# EAGLE design Light TO220 (EAGLE 9.2.2)
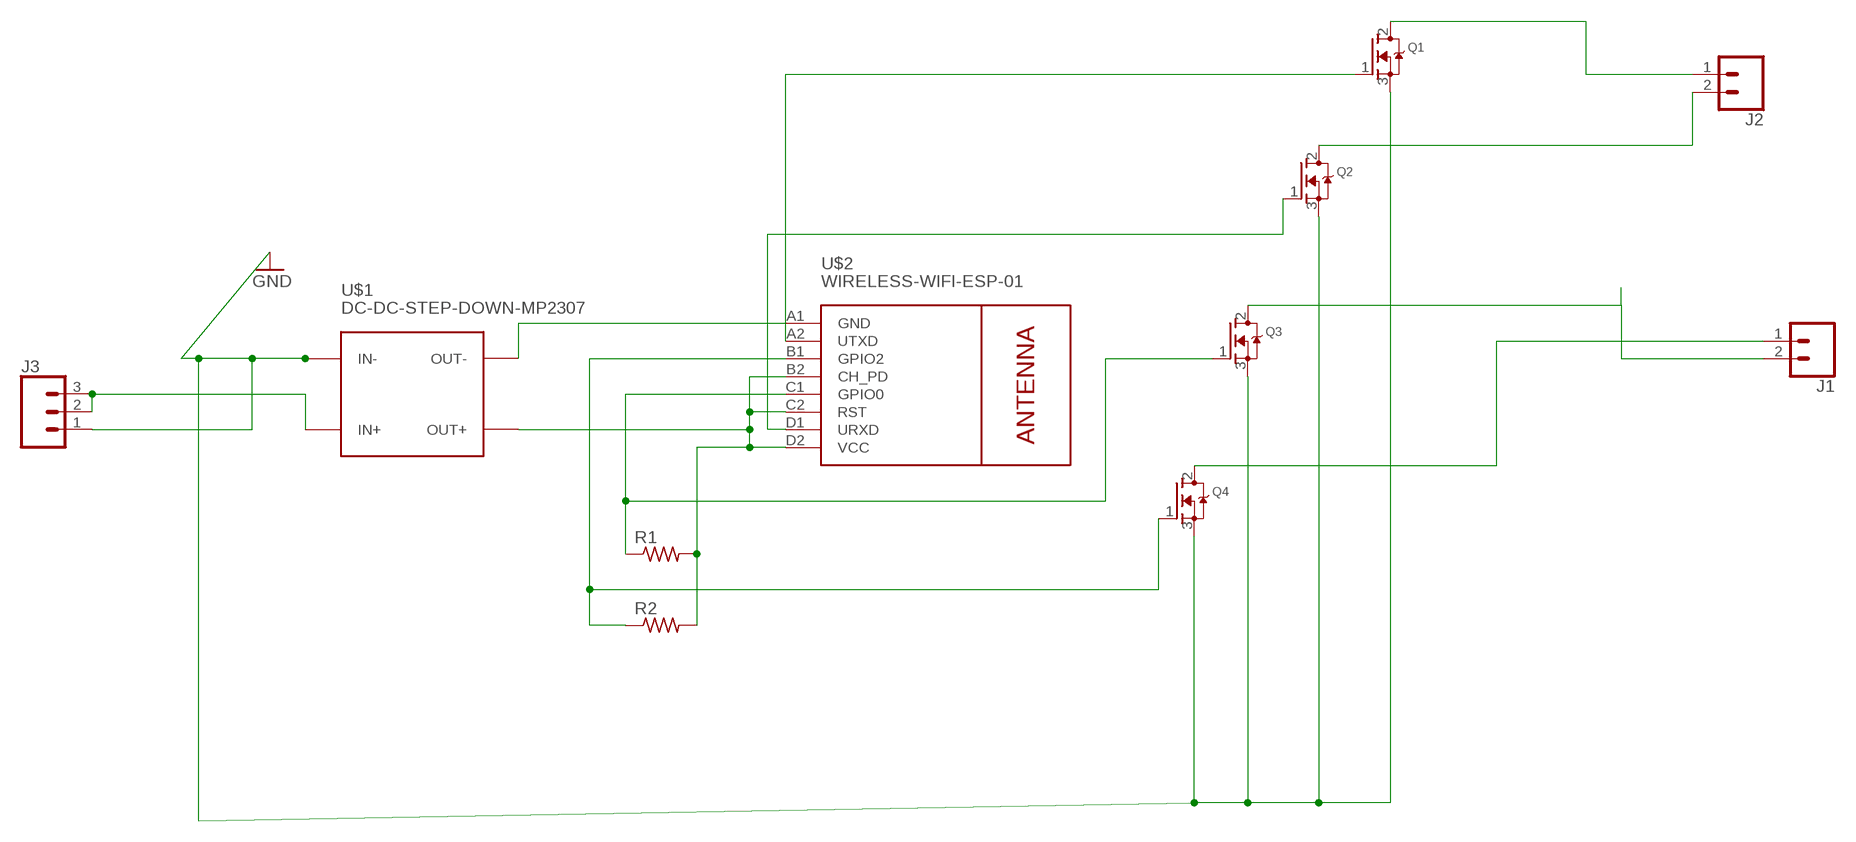
[diagram p0: schematic, sheet 1]

## Parts
J1  CONN_023.5MM  [SCREWTERMINAL-3.5MM-2]
J2  CONN_023.5MM  [SCREWTERMINAL-3.5MM-2]
J3  CONN_03SCREW  [SCREWTERMINAL-3.5MM-3]
Q1  MOSFET-NGDS_TO220V  [TO220V]
Q2  MOSFET-NGDS_TO220V  [TO220V]
Q3  MOSFET-NGDS_TO220V  [TO220V]
Q4  MOSFET-NGDS_TO220V  [TO220V]
R1  R-US_R0805  [R0805]
R2  R-US_R0805  [R0805]
U$1  DC-DC-STEP-DOWN-MP2307  [DC-DC-STEP-DOWN-MP2307]
U$2  WIRELESS-WIFI-ESP-01  [WIRELESS-WIFI-ESP-01]

## Nets
GND: J3.1 Q1.3(S) Q2.3(S) Q3.3(S) Q4.3(S) U$1.IN-
N$1: R1.2 R2.2 U$1.OUT+ U$2.B2(CH_PD) U$2.C2(RST) U$2.D2(VCC)
N$2: Q2.1(G) U$2.D1(URXD)
N$3: U$1.OUT- U$2.A1(GND)
N$4: Q3.1(G) R1.1 U$2.C1(GPIO0)
N$5: Q4.1(G) R2.1 U$2.B1(GPIO2)
N$6: Q1.1(G) U$2.A2(UTXD)
N$7: J3.2 J3.3 U$1.IN+
N$8: J2.1 Q1.2(D)
N$9: J2.2 Q2.2(D)
N$10: J1.1 Q4.2(D)
N$11: J1.2 Q3.2(D)

## Library data of the parts
J1 J2 = custom:CONN_02: Multi connection point. Often used as Generic Header-pin footprint for 0.1 inch spaced/style header connections On any of the 0.1 inch spaced packages, you can populate with these: Break Away Headers - Straight <https://www.sparkfun.com/products/116> (PRT-00116) Break Away Male Headers - Right Angle <https://www.sparkfun.com/products/553> (PRT-00553) Female Headers <https://www.sparkfun.com/products/115> (PRT-00115) Break Away Headers - Machine Pin <https://www.sparkfun.com/products/117> (PRT-00117) Break Away Female Headers - Swiss Machine Pin <https://www.sparkfun.com/products/743> (PRT-00743) For SCREWTERMINALS and SPRING TERMINALS visit here: Screw Terimnals on SparkFun.com <https://www.sparkfun.com/search/results?term=Screw+Terminals> (5mm/3.5mm/2.54mm spacing) This device is also useful as a general connection point to wire up your design to another part of your project. Our various solder wires solder well into these plated through hole pads. Hook-Up Wire - Assortment (Stranded, 22 AWG) <https://www.sparkfun.com/products/11375> (PRT-11375) Hook-Up Wire - Assortment (Solid Core, 22 AWG) <https://www.sparkfun.com/products/11367> (PRT-11367) View the entire wire category on our website here <https://www.sparkfun.com/categories/141> Special notes: Molex polarized connector foot print use with: PRT-08233 with associated crimp pins and housings. 2.54_SCREWTERM for use with PRT-10571. 3.5mm Screw Terminal footprints for PRT-08084 5mm Screw Terminal footprints for use with PRT-08432; PROD_ID: CONN-08399
J3 = custom:CONN_03: Multi connection point. Often used as Generic Header-pin footprint for 0.1 inch spaced/style header connections On any of the 0.1 inch spaced packages, you can populate with these: Break Away Headers - Straight <https://www.sparkfun.com/products/116> (PRT-00116) Break Away Male Headers - Right Angle <https://www.sparkfun.com/products/553> (PRT-00553) Female Headers <https://www.sparkfun.com/products/115> (PRT-00115) Break Away Headers - Machine Pin <https://www.sparkfun.com/products/117> (PRT-00117) Break Away Female Headers - Swiss Machine Pin <https://www.sparkfun.com/products/743> (PRT-00743) Stackable Header - 3 Pin (Female, 0.1") <https://www.sparkfun.com/products/13875> (PRT-13875) For SCREWTERMINALS and SPRING TERMINALS visit here: Screw Terimnals on SparkFun.com <https://www.sparkfun.com/search/results?term=Screw+Terminals> (5mm/3.5mm/2.54mm spacing) This device is also useful as a general connection point to wire up your design to another part of your project. Our various solder wires solder well into these plated through hole pads. Hook-Up Wire - Assortment (Stranded, 22 AWG) <https://www.sparkfun.com/products/11375> (PRT-11375) Hook-Up Wire - Assortment (Solid Core, 22 AWG) <https://www.sparkfun.com/products/11367> (PRT-11367) View the entire wire category on our website here <https://www.sparkfun.com/categories/141> Special notes: Molex polarized connector foot print use with SKU : PRT-08232 with associated crimp pins and housings.; PROD_ID: CONN-08288; SF_ID: PRT-08235
Q1-Q4 = adafruit:MOSFET-N: N-Channel Mosfet 2N7002E - 60V 260mA SOT23 [Digikey: 2N7002ET1GOSTR-ND] - REEL BSH103 - 30V 850mA SOT23 [Digikey: 568-5013-1-ND]
R1 R2 = adafruit:R-US_: RESISTOR, American symbol
U$1 = custom:DC-DC-STEP-DOWN-MP2307: DC/DC Step-Down Regulator based on MP2307DN chip MP2307 datasheet available here: https://cdn-shop.adafruit.com/datasheets/MP2307_r1.9.pdf Click here to find device on ebay.com <http://www.ebay.com/sch/dc+dc+3a+mini+converter>; OC_FARNELL: unknown
U$2 = custom:WIRELESS-WIFI-ESP-01: Wireless Wi-Fi ESP-01 Module based on ESP8266 chip Click here to find device on ebay.com <http://www.ebay.com/sch/esp8266+esp+01+transceiver>; OC_FARNELL: unknown; SPICEPREFIX: X

## Board
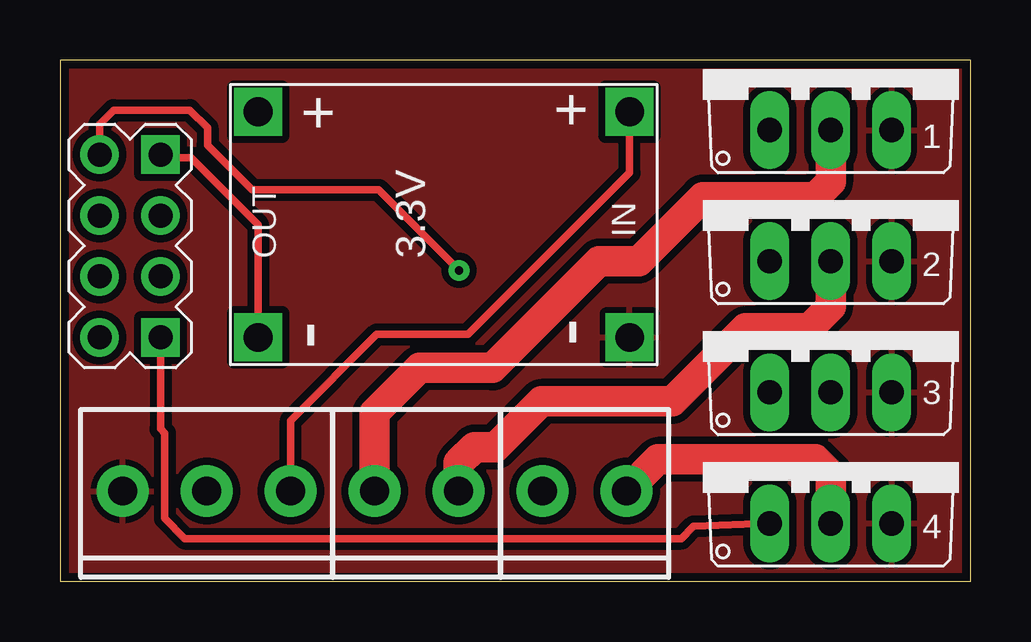
[diagram p1: board, top side]
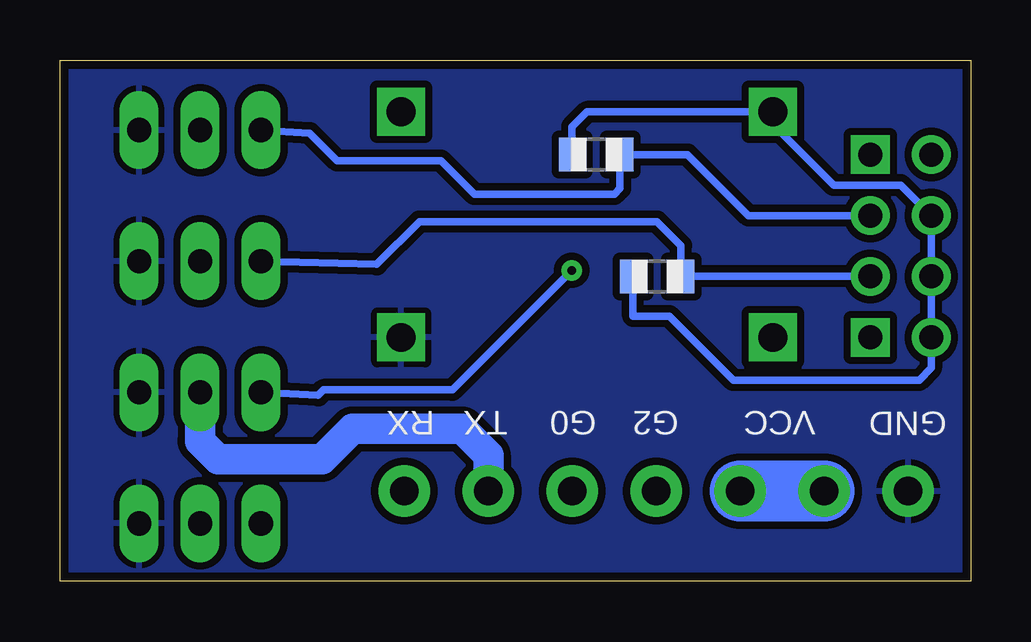
[diagram p2: board, bottom side, seen from below]

Size 37.97 x 21.72 mm. Coordinates in mm from the lower left corner, seen from the top.
Outline: 0,0 37.97,0.01 37.97,21.72 0,21.71 0,0
Copper layers (1*16): Top 0.035mm / dielectric 1.5mm / Bottom 0.035mm
Design rules "default *": minimum track width 6mil, minimum drill 0.35mm, track to track 12mil, track to pad 12mil, pad to pad 12mil, via to via 12mil, smd to smd 12mil, copper to edge 14mil, drill to drill 6mil, minimum pad ring 12mil, minimum via ring 10mil, stop-mask expansion 4mil, vias tented up to drill 15mil, thermal gap 10mil

### Footprints (pad centres in the part's own frame; a part is rotated, then mirrored left to right if it is on the bottom)
SCREWTERMINAL-3.5MM-2 = drill 1.2 pad 2.159: 1 0,0; 2 3.5,0
SCREWTERMINAL-3.5MM-3 = drill 1.2 pad 2.159: 1 0,0; 2 3.5,0; 3 7,0
TO220V = drill 1.016 long: 1 -2.54,-2.54; 2 0,-2.54; 3 2.54,-2.54
R0805 = smd 1.1 x 1.4: 1 -1,0; 2 1,0
DC-DC-STEP-DOWN-MP2307 = drill 1.2 pad 2 square: IN+ -7.747,-4.699; IN- -7.747,4.699; OUT+ 7.747,-4.699; OUT- 7.747,4.699
WIRELESS-WIFI-ESP-01 = drill 1 square: A1 -8.89,3.81; D1 -8.89,-3.81 | drill 1: A2 -11.43,3.81; B1 -8.89,1.27; B2 -11.43,1.27; C1 -8.89,-1.27; C2 -11.43,-1.27; D2 -11.43,-3.81

### Placement (x,y rotation side)
J1  13.12,3.76 0 top
J2  20.12,3.76 0 top
J3  2.62,3.76 0 top
Q1  32.13,10.41 0 top
Q2  32.13,4.95 0 top
Q3  32.13,15.88 0 top
Q4  32.13,21.34 0 top
R1  13.08,12.7 180 bottom
R2  15.62,17.78 180 bottom
U$1  16,14.86 180 top
U$2  13.08,13.97 0 top

### Tracks (layer width: path | path; a pad name or v marks a point on that pad's centre or on a via)
GND
  pour Top: 0,21.72 0,0 37.97,0 37.97,21.72
  pour Bottom: 0,21.72 0,0 37.97,0 37.97,21.72
N$1
  Bottom 0.254: R2.2 16.75,17.65
  Bottom 0.305: R2.2 16.62,18.94 16,19.56 U$1.OUT+ 8.25,19.05 5.71,16.51 2.92,16.51 U$2.B2 U$2.C2 U$2.D2 1.65,8.89 2.16,8.38 9.91,8.38 12.57,11.05 14.08,11.05 R1.2
N$2
  Top 0.305: U$2.D1 4.19,6.35 4.37,6.17 4.37,2.62 5.21,1.78 25.91,1.78 26.42,2.29 Q2.1
N$3
  Top 0.305: U$2.A1 4.32,17.65 5.46,17.65 8.25,14.86 U$1.OUT-
N$4
  Bottom 0.305: U$2.C1 R1.1 12.08,13.99 13.08,14.99 22.99,14.99 24.76,13.21 Q3.1
N$5
  Bottom 0.305: U$2.B1 9.27,15.24 11.81,17.78 R2.1 14.62,16.37 14.86,16.13 20.7,16.13 22.1,17.53 26.42,17.53 27.56,18.67 Q4.1
N$6  (via drill 0.35)
  Top 0.305: U$2.A2 1.65,19.05 2.23,19.63 5.41,19.63 6.15,18.9 6.15,18.16 8,16.31 13.28,16.31 v16.64,12.95
  Bottom 0.305: v16.64,12.95 21.61,7.98 26.97,7.98 27.2,7.75 Q1.1
N$7
  Top 0.305: J3.3 9.62,6.7 13.21,10.29 17.02,10.29 23.75,17.02 U$1.IN+
  Bottom 2.54: J3.2 J3.3
N$8
  Bottom 1.27: Q1.2 32.13,5.84 31.37,5.08 27.05,5.08 25.78,6.35 21.21,6.35 20.12,5.26 J2.1
N$9
  Top 1.27: Q2.2 32.13,4.45 31.5,5.08 24.94,5.08 J2.2
N$10
  Top 1.27: Q4.2 32.13,16.64 31.5,16 26.8,16 24.13,13.34 22.48,13.34 18.03,8.89 14.99,8.89 13.12,7.02 J1.1
N$11
  Top 1.27: Q3.2 32.13,11.43 31.24,10.54 28.57,10.54 25.53,7.49 20.07,7.49 18.16,5.59 17.27,5.59 16.62,4.93 J1.2

### Text on the board
tPlace: + | + | 1 | IN | OUT | 3.3V | 2 | - | - | 3 | 4
bPlace: GND | VCC | G2 | G0 | TX | RX